# Altium schematic sheet masterUnit.SchDoc
size A4; SheetNumber: 4; SheetTotal: 7
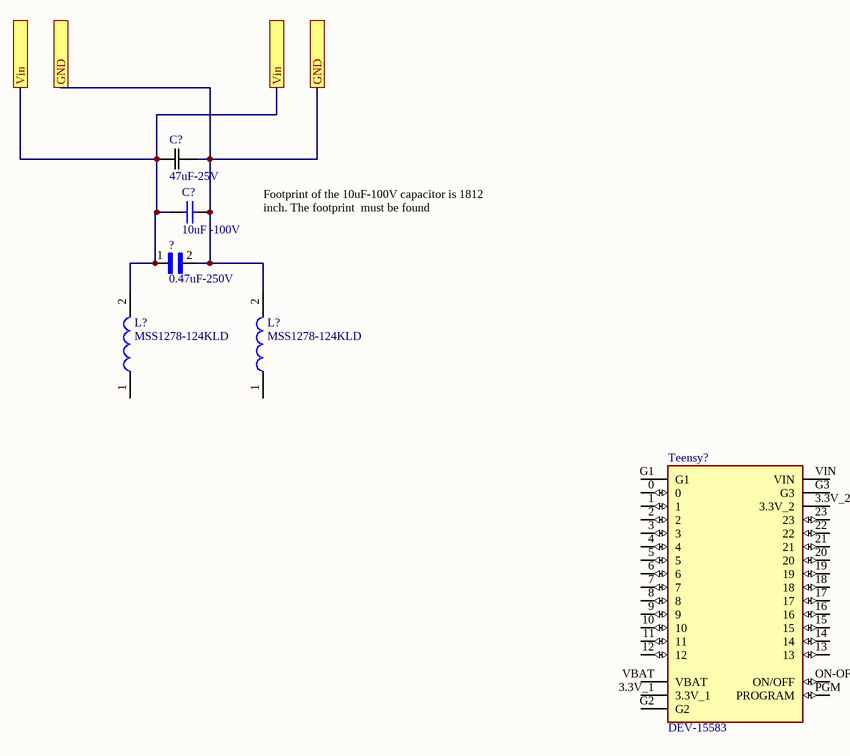
[diagram p0: masterUnit.SchDoc]

## Parts
(Parts that share a designator on the sheet are numbered #1, #2 ... from top to bottom, then left to right.)
?  0.47uF-250V  [CAPC3326X280N]
C?#1  47uF-25V
C?#2  value 10uF -100V  (hidden comment: Symbol)
L?#1  MSS1278-124KLD  [INDPM120120X805N]
L?#2  MSS1278-124KLD  [INDPM120120X805N]
Teensy?  DEV-15583  [MODULE_DEV-15583]

## Ports
GND, Vin

## Nets
GND: ?.2 C?#1.2 C?#2.2 L?#2.2 ; port GND
Vin: ?.1 C?#1.1 C?#2.1 L?#1.2 ; port Vin

Not connected (* = marked no-connect by the designer): L?#1 1; L?#2 1; Teensy? 0 1 2 3 3.3V_1 3.3V_2 4 5 6 7 8 9 10 11 12 13 14 15 16 17 18 19 20 21 22 23 G1 G2 G3 ON-OFF(ON/OFF) PGM(PROGRAM) VBAT VIN

## Notes on the sheet
- Footprint of the 10uF-100V capacitor is 1812 inch. The footprint  must be found

## Library data of the parts
? = CMP-010-000002-1: MF: {'manufacturer': u'KEMET'}; MP: C1210X474KARACAUTO; Value: *; Package: None; Price: None; Availability: Unavailable; Component Type: Standard; Design Item ID: C1210X474KARACAUTO; Pin Count: 2; Source: workerBoard.SCHLIB
C?#1 = CMP-003-000007-1: No Description Available; Mfr_Name: Murata; Type: DEV; Copyright: Copyright (C) 2021 Ultra Librarian. All rights reserved.; Manufacturer_Part_Number: GRM31CR61E476ME44K; RefDes: RefDes; Component Type: Standard; Design Item ID: GRM31CR61E476ME44K; Pin Count: 2; Source: workerBoard.SCHLIB
C?#2 = CMP-003-000004-1: Capacitor; SimulationGenericComponent: True; Component Type: Standard; Design Item ID: Capacitor; Pin Count: 2; Source: workerBoard.SCHLIB
L?#1 L?#2 = CMP-006-000002-1: Inductor; Manufacturer_Name: COILCRAFT; Datasheet Link: https://componentsearchengine.com/Datasheets/1/MSS1278-124KLD.pdf; Height: 8.05mm; Manufacturer_Part_Number: MSS1278-124KLD; Component Type: Standard; Design Item ID: MSS1278-124KLD; Pin Count: 2; Source: workerBoard.SCHLIB
Teensy? = CMP-010-000005-1: RT1062 Teensy 4.0 i.MX ARMÂ® CortexÂ®-M7 MPU Embedded Evaluation Board; MF: SparkFun Electronics; Pin Count: 33; Package: None; Digi-Key_Purchase_URL: https://www.digikey.com/product-detail/en/sparkfun-electronics/DEV-15583/1568-DEV-15583-ND/10384551?utm_source=snapeda&utm_medium=aggregator&utm_campaign=symbol; Design Item ID: DEV-15583; Component Type: Standard; MP: DEV-15583; Source: workerBoard.SCHLIB; SnapEDA_Link: https://www.snapeda.com/parts/DEV-15583/SparkFun%20Electronics/view-part/4001229/?ref=snap; Value: *; Digi-Key_Part_Number: 1568-DEV-15583-ND